# EAGLE design Irdroid_USB_IRDA (EAGLE 6.5.0)
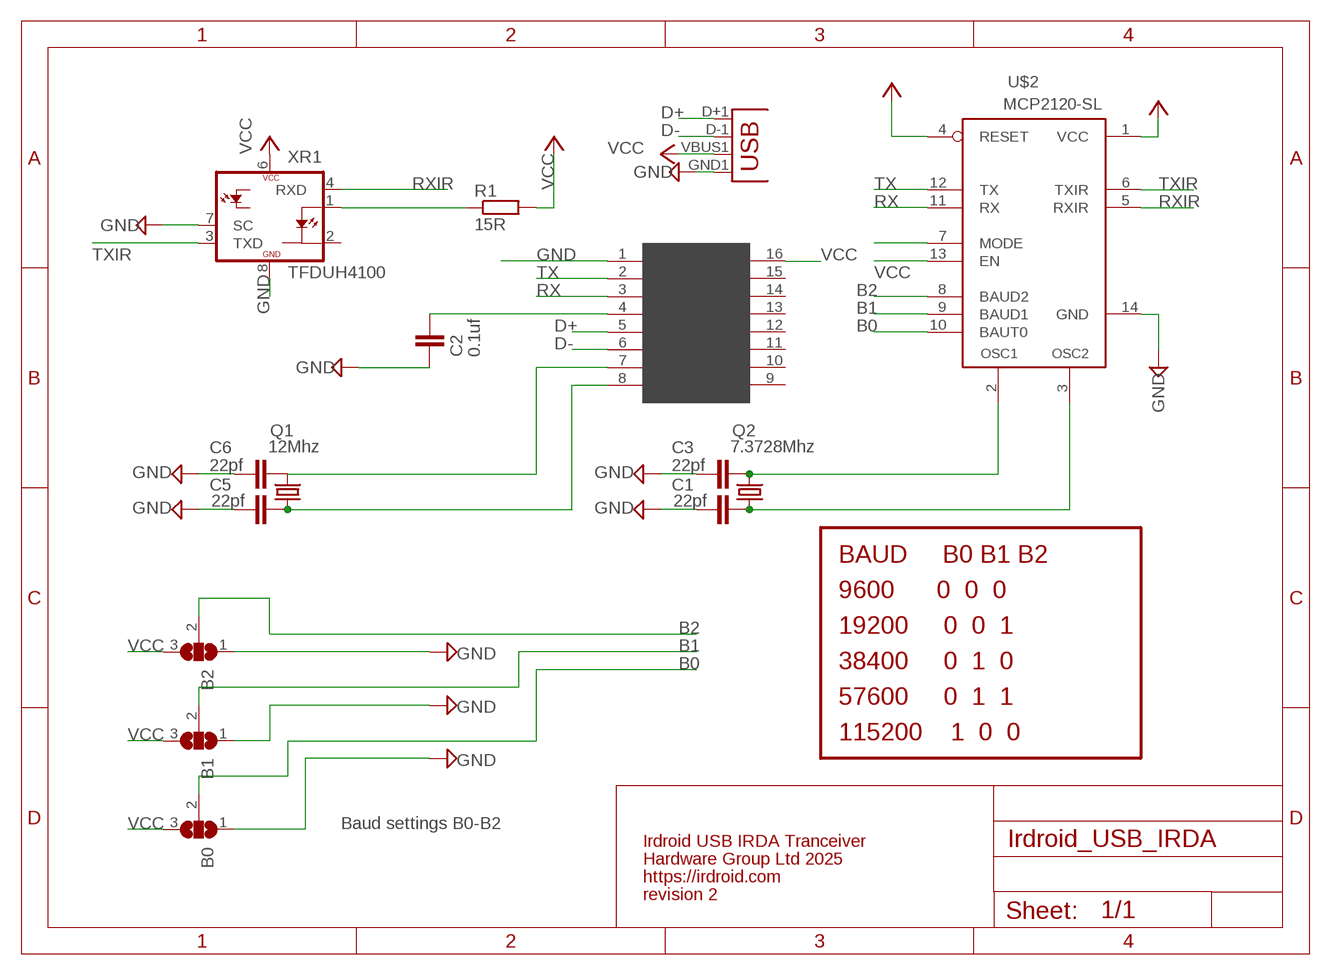
[diagram p0: schematic, sheet 1]

## Parts
B0  SJ2W  [SJ_2]
B1  SJ2W  [SJ_2]
B2  SJ2W  [SJ_2]
C1  22pf  CAPC603  [C603]
C2  0.1uf  CAPC603  [C603]
C3  22pf  CAPC603  [C603]
C5  22pf  CAPC603  [C603]
C6  22pf  CAPC603  [C603]
JP2  USBA-SMD-MALE  [USB-A-SMT-MALE]
Q1  12Mhz  CRYSTALHC49UP  [HC49UP]
Q2  7.3728Mhz  CRYSTALHC49UP  [HC49UP]
R1  15R  R-EU_R0603  [R0603]
U$1  ch  CH340G  [SOIC16]
U$2  MCP2120-SL  [SO-14]
XR1  TFDUH4100  [TFDU4-HOR]

## Nets
B0: B0.2 U$2.10(BAUT0)
B1: B1.2 U$2.9(BAUD1)
B2: B2.2 U$2.8(BAUD2)
D+: JP2.D+1(D+) U$1.5(D+)
D-: JP2.D-1(D-) U$1.6(D-)
GND: B0.1 B1.1 B2.1 C1.2 C2.2 C3.2 C5.2 C6.2 JP2.GND1(GND) U$1.1(GND) U$2.14(GND) XR1.7(SC) XR1.8(GND)
N$2: C5.1 Q1.1 U$1.8(XO)
N$3: C3.1 Q2.2 U$2.2(OSC1)
N$4: C6.1 Q1.2 U$1.7(XI)
N$5: C1.1 Q2.1 U$2.3(OSC2)
N$6: C2.1 U$1.4(V3)
N$8: R1.1 XR1.1(IRED-A)
RX: U$1.3(RX) U$2.11(RX)
RXIR: U$2.5(RXIR) XR1.4(RXD)
TX: U$1.2(TX) U$2.12(TX)
TXIR: U$2.6(TXIR) XR1.3(TXD)
VCC: B0.3 B1.3 B2.3 JP2.VBUS1(VBUS) R1.2 U$1.16(VCC) U$2.1(VCC) U$2.4(RESET) U$2.7(MODE) U$2.13(EN) XR1.6(VCC)
Unconnected: U$1.9(CTS) U$1.10(DSR) U$1.11(RI) U$1.12(DCD) U$1.13(DTR) U$1.14(RTS) U$1.15(RS232) XR1.2(IRED-C)

## Notes on the sheet
- BAUD     B0 B1 B2
- 9600      0  0  0
- 19200     0  0  1
- 38400     0  1  0
- 57600     0  1  1
- 115200    1  0  0
- Baud settings B0-B2
- Irdroid USB IRDA Tranceiver
- Hardware Group Ltd 2025
- https://irdroid.com
- revision 2

## Library data of the parts
B0 B1 B2 = jumper:SJ2W: SMD solder JUMPER
C1-C3 C5 C6 = dp_devices:CAP
JP2 = SparkFun-Connectors:USB: USB Connectors USB-B-PTH is fully proven SKU : PRT-00139/CONN-08278 USB-miniB is fully proven SKU : PRT-00587 USB-A-PCB is untested. USB-A-H is throughly reviewed, but untested. Spark Fun Electronics SKU : PRT-00437 USB-B-SMT is throughly reviewed, but untested. Needs silkscreen touching up. USB-A-S has not been used/tested USB-MB-H has not been used/tested USB-MICROB has been used. CONN-09505
Q1 Q2 = crystal:CRYSTAL: CRYSTAL; OC_FARNELL: unknown; OC_NEWARK: unknown
R1 = resistor:R-EU_: RESISTOR, European symbol
U$1 = usb-serial:CH340G
U$2 = microchip_mcp2120:MCP2120: Infrared Encoder/Decoder
XR1 = opto-vishay:TFD?4100: 2.7 V to 5.5 V Serial Infrared Transceiver Module Family (SIR, 115.2 kbit/s) Vishay Telefunken; MPN: TFDU4101-TT3; OC_FARNELL: 1652525; OC_NEWARK: 27M9702

## Net classes
2 gnd: width 0.305 mm, drill 0.559 mm, clearance 0.254 mm

## Board
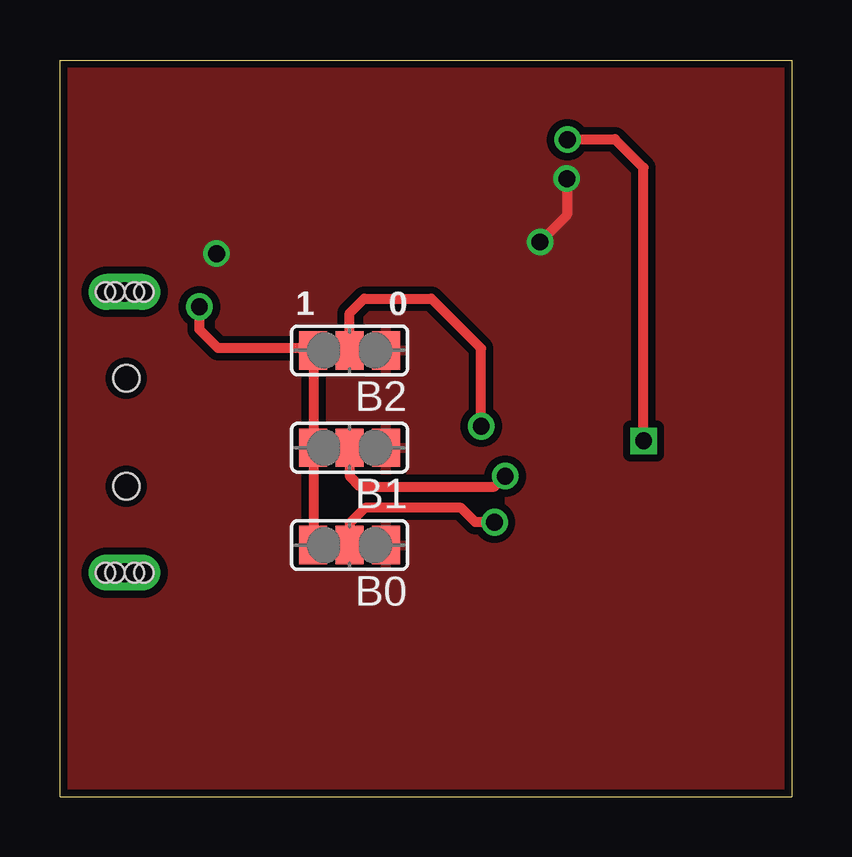
[diagram p1: board, top side]
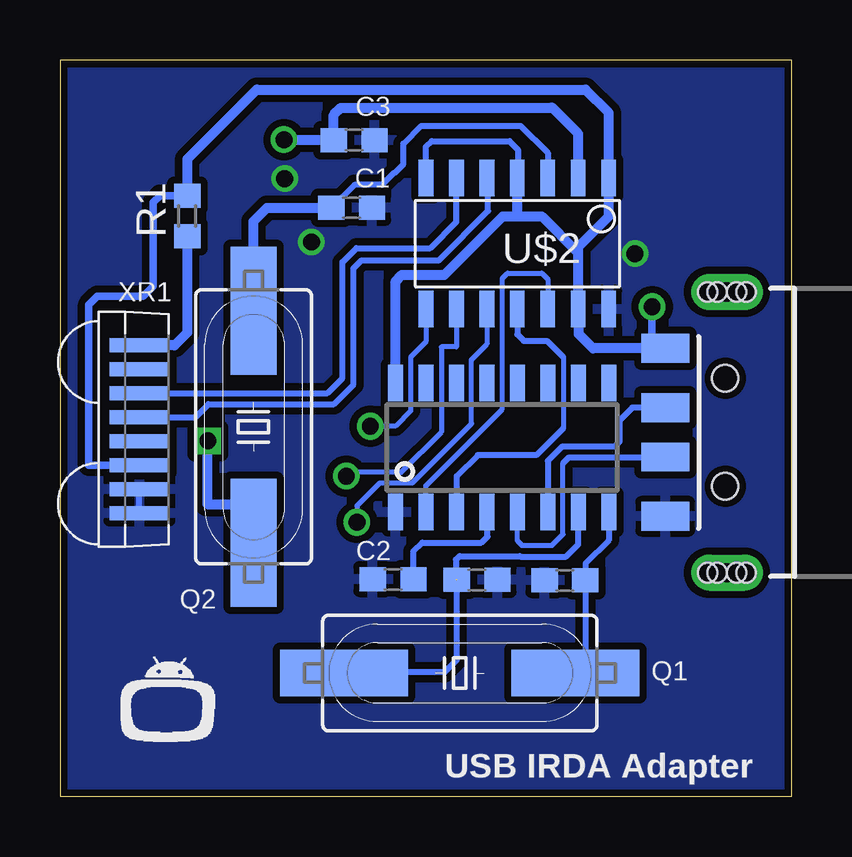
[diagram p2: board, bottom side, seen from below]

Size 30.5 x 30.7 mm. Coordinates in mm from the lower left corner, seen from the top.
Outline: 0,0 30.5,0 30.5,30.7 0,30.7 0,0
Copper layers (1*16): Top 0.035mm / dielectric 1.5mm / Bottom 0.035mm
Design rules "default *": minimum track width 8mil, minimum drill 24mil, track to track 8mil, track to pad 8mil, pad to pad 8mil, via to via 8mil, smd to smd 8mil, copper to edge 12mil, drill to drill 8mil, minimum pad ring 10mil, minimum via ring 8mil, stop-mask expansion 4mil, vias tented up to drill 0mil, thermal gap 10mil

### Footprints (pad centres in the part's own frame; a part is rotated, then mirrored left to right if it is on the bottom)
SJ_2 = smd 1.168 x 1.6: 1 -1.524,0; 2 0,0; 3 1.524,0
C603 = smd 1.1 x 1: 1 -0.85,0; 2 0.85,0
USB-A-SMT-MALE = smd 1.2 x 2: D+1 1.027,-3.67; D-1 -1.027,-3.67; GND1 3.5,-3.67; VBUS1 -3.5,-3.67 | drill 0.8 pad 1.5 long: P$1 5.85,-1.1; P$3 -5.85,-1.1 | hole 1.1: 2.25,-1.17; -2.25,-1.17 | hole 0.8: -5.85,-1.5; -5.85,-1.9; -5.85,-0.7; -5.85,-0.3; 5.85,-1.5; 5.85,-1.9; 5.85,-0.7; 5.85,-0.3
HC49UP = smd 5.334 x 1.93: 1 -4.826,0; 2 4.826,0
R0603 = smd 1 x 1.1: 1 -0.85,0; 2 0.85,0
SOIC16 = smd 0.635 x 1.524: 1 -4.445,-2.695; 2 -3.175,-2.695; 3 -1.905,-2.695; 4 -0.635,-2.695; 5 0.635,-2.695; 6 1.905,-2.695; 7 3.175,-2.695; 8 4.445,-2.695; 9 4.445,2.695; 10 3.175,2.695; 11 1.905,2.695; 12 0.635,2.695; 13 -0.635,2.695; 14 -1.905,2.695; 15 -3.175,2.695; 16 -4.445,2.695
SO-14 = smd 0.61 x 1.524: 1 -3.81,-2.794; 2 -2.54,-2.794; 3 -1.27,-2.794; 4 0,-2.794; 5 1.27,-2.794; 6 2.54,-2.794; 7 3.81,-2.794; 8 3.81,2.667; 9 2.54,2.667; 10 1.27,2.667; 11 0,2.667; 12 -1.27,2.667; 13 -2.54,2.667; 14 -3.81,2.667
TFDU4-HOR = smd 0.6 x 2.5: 1 -3.5,0; 2 -2.5,0; 3 -1.5,0; 4 -0.5,0; 5 0.5,0; 6 1.5,0; 7 2.5,0; 8 3.5,0

### Placement (x,y rotation side)
B0  12.07,10.49 180 top
B1  12.07,14.54 180 top
B2  12.07,18.6 180 top
C1  18.34,24.54 0 bottom
C2  16.61,9.07 180 bottom
C3  18.24,27.36 0 bottom
C5  9.45,9.02 180 bottom
C6  13.11,9.04 0 bottom
JP2  1.6,15.19 270 bottom
Q1  13.83,5.16 180 bottom
Q2  22.43,15.42 270 bottom
R1  25.19,24.2 90 bottom
U$1  12.06,14.55 0 bottom
U$2  11.43,22.99 180 bottom
XR1  27.18,15.32 270 bottom

### Tracks (layer width: path | path; a pad name or v marks a point on that pad's centre or on a via)
B0  (via drill 0.7 pad 0.25)
  Top 0.406: v18.12,11.44 17.32,11.44 16.72,12.04 12.72,12.04 12.08,11.4 B0.2
  Bottom 0.203: v18.12,11.44 18.12,12.12 17.16,13.08 15.81,13.08 13.34,15.55 13.34,18.2 13.35,18.21 12.7,18.86 U$2.10
B1  (via drill 0.7)
  Top 0.406: B1.2 12.07,13.37 12.52,12.92 18.12,12.92 v18.56,13.36
  Bottom 0.203: U$2.9 13.97,18.75 14.6,18.75 14.6,15.2 16.28,13.52 18.4,13.52 v18.56,13.36
B2  (via drill 0.7)
  Top 0.406: B2.2 12.07,20.15 12.68,20.76 15.48,20.76 17.56,18.68 v17.56,15.44
  Bottom 0.203: U$2.8 15.24,18.96 15.88,18.32 15.88,16.08 16.52,15.44 v17.56,15.44
D+
  Bottom 0.203: 9.53,13.89 9.53,10.93 9.98,10.48 11.24,10.48 11.43,10.67 U$1.5
  Bottom 0.254: 9.53,13.89 9.27,14.15 5.28,14.15 JP2.D+1
D-
  Bottom 0.254: JP2.D-1 6.65,16.21 7.16,15.7 7.16,14.81 7.37,14.61 9.55,14.61 10.16,13.99 U$1.6
GND  (via drill 0.7)
  Top 0.406: v21.13,25.76 21.13,24.23 v20.02,23.11
  Bottom 0.254: C5.2 10.16,8.94 10.34,8.98 | XR1.8 27.23,11.79 27.23,12.6 XR1.7
  other vias: 6.53,22.63
  pour Bottom (isolate 0.305): 0.1,30.68 30.78,30.68 30.78,0 0.1,0
  pour Top (isolate 0.305): 0.1,30.68 30.68,30.68 30.68,0.1 0.1,0.1
N$2
  Bottom 0.254: U$1.8 7.62,10.69 8.59,9.73 8.59,9.04 | 8.59,9.04 C5.1 | 8.59,9.04 8.59,5.58 Q1.1
  Bottom 0.406: Q1.1 10.76,5.79 10.37,5.79 | 8.48,9.24 C5.1
N$3  (via drill 0.7)
  Top 0.406: v24.33,14.83 24.33,26.21 23.14,27.41 21.18,27.41 v21.16,27.38
  Bottom 0.406: 19.09,27.33 C3.1 | Q2.2 22.43,12.2 24.36,12.2 24.36,14.83 v24.33,14.83 | v21.16,27.38 19.11,27.38 C3.1 | U$2.2 8.89,27.62 10,28.73 10.02,28.71 18.79,28.71 19.09,28.41 C3.1
N$4  (1 unrouted)
  Bottom 0.254: C6.1 13.96,5.7 14.48,5.18 18.63,5.18 Q1.2 | U$1.7 8.89,10.52 9.4,10.01 11.3,10.01 11.33,10.03 13.84,10.03 13.99,9.88 13.99,9.07
N$5
  Bottom 0.254: C1.1 18.22,25.5 17.07,25.5 16.59,25.98 16.56,25.98 16.18,26.36 16.18,27.22 15.44,27.96 11.29,27.96 10.16,26.83 U$2.3
  Bottom 0.406: Q2.1 22.43,23.98 21.87,24.54 C1.1
N$6
  Bottom 0.254: U$1.4 12.68,11.83 12.68,10.85 12.93,10.59 15.39,10.59 15.76,10.22 C2.1
N$7
  Bottom 0.305: 26.54,12.77 26.54,12.71
N$8
  Bottom 0.406: R1.1 25.19,19.34 25.73,18.81 XR1.1
RX
  Bottom 0.203: 9.52,18.32 9.52,15.36
  Bottom 0.254: U$2.11 11.43,19.27 11.16,19 10.2,19 9.52,18.32 | 9.52,15.36 10.64,14.24 13.08,14.24 13.96,13.36 U$1.3
RXIR
  Bottom 0.254: U$2.5 12.65,25.73 12.65,24.41 14.71,22.35 17.93,22.35 18.26,22.02 18.26,17.17 19.07,16.36 24.31,16.36 24.85,15.82 XR1.4
TX
  Bottom 0.203: U$2.12 10.16,21.57 10.41,21.82 11.84,21.82 12.06,21.6 12.06,16.15 15.24,12.97 U$1.2
TXIR
  Bottom 0.254: XR1.3 19.35,16.82 18.72,17.45 18.72,22.28 18.14,22.86 15.06,22.86 13.97,23.95 U$2.6
VCC  (via drill 0.7)
  Top 0.254: 10.57,10.57 B0.3 | 10.57,14.22 B1.3 10.57,14.63 | 10.57,18.29 B2.3 10.16,18.69
  Top 0.406: 10.16,18.69 6.59,18.69 5.82,19.47 v5.82,20.42 | 10.57,18.29 10.57,14.56 B1.3 | 10.57,14.22 10.57,10.51 B0.3
  Bottom 0.254: U$2.7 15.24,27.08 15,27.32 11.76,27.32 11.4,26.96 11.4,25.81 U$2.4
  Bottom 0.305: 5.41,18.83 JP2.VBUS1 5.82,19.23 v5.82,20.42 | XR1.6 29.3,13.82 29.3,20.49 28.94,20.85 27.03,20.85 26.61,21.27 26.61,24.77 26.33,25.05 R1.2
  Bottom 0.406: 8.89,22.66 U$2.13 8.87,20.3 8.87,19.28 8.27,18.69 JP2.VBUS1 5.53,18.95 | 8.89,22.66 8.89,22.91 7.62,24.18 U$2.1 | U$1.16 16.51,21.49 16.26,21.74 14.48,21.74 12.04,24.18 11.43,24.18 | 11.43,24.18 U$2.4 | 11.43,24.18 10.41,24.18 8.89,22.66 | 7.59,25.81 U$2.1 | 25.21,25.03 R1.2 25.19,26.57 25.2,26.57 22.3,29.46 8.59,29.46 7.62,28.5 U$2.1

### Text on the board
bPlace: USB IRDA Adapter
tNames: 1 | 0